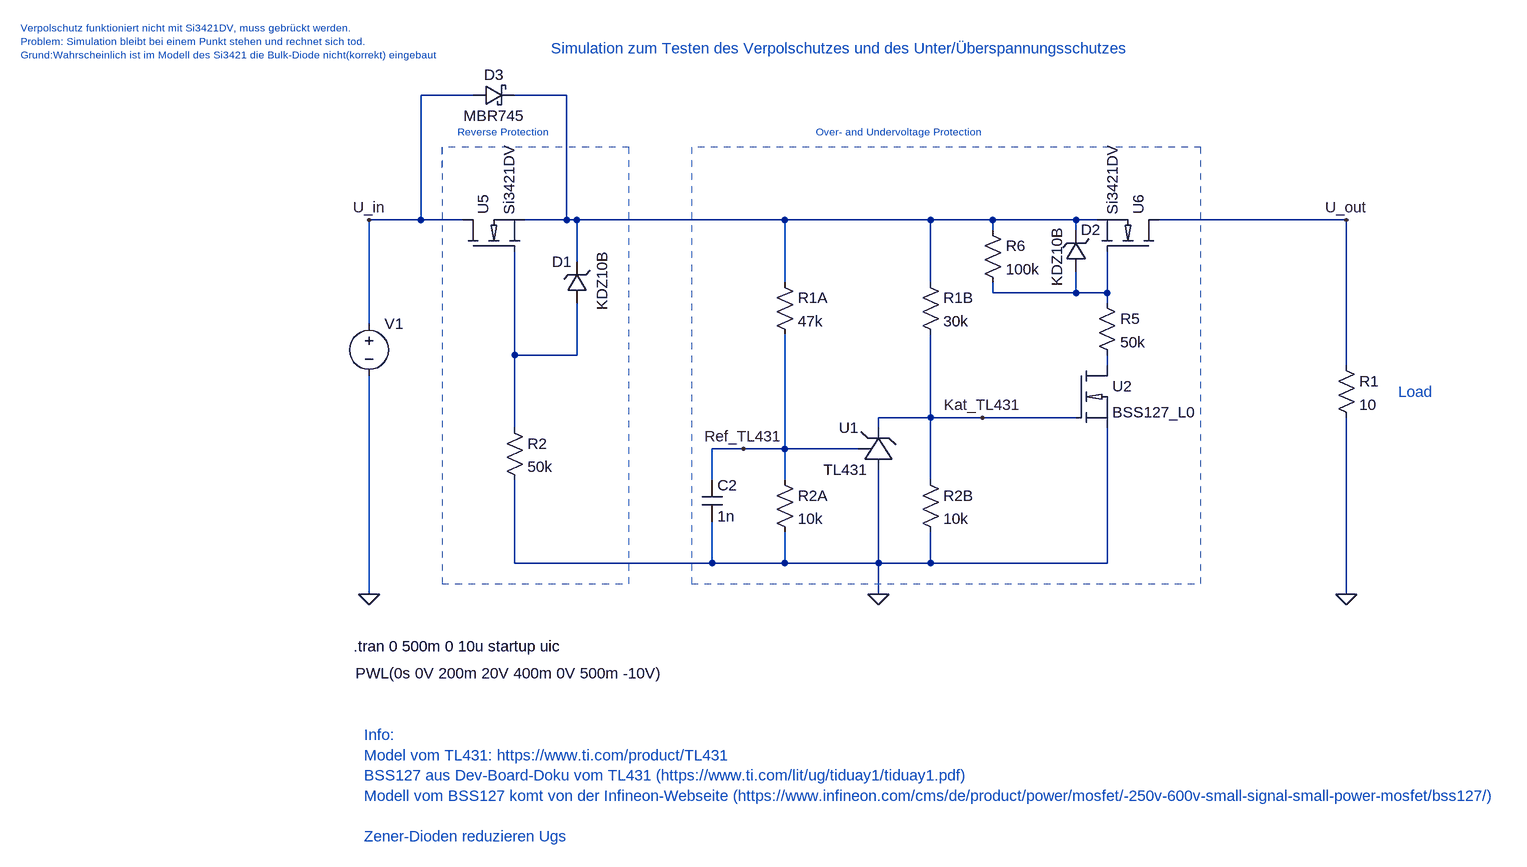
[diagram p0: schematic OV_Reverse_Protection.asc]
OV_Reverse_Protection.asc, the LTspice schematic file:
Version 4
SHEET 1 1664 836
WIRE -656 -304 -736 -304
WIRE -512 -304 -592 -304
WIRE -736 -112 -736 -304
WIRE -736 -112 -816 -112
WIRE -672 -112 -736 -112
WIRE -512 -112 -512 -304
WIRE -512 -112 -576 -112
WIRE -496 -112 -512 -112
WIRE -176 -112 -496 -112
WIRE 48 -112 -176 -112
WIRE 144 -112 48 -112
WIRE 272 -112 144 -112
WIRE 304 -112 272 -112
WIRE 688 -112 400 -112
WIRE 144 -96 144 -112
WIRE 272 -96 272 -112
WIRE -496 -48 -496 -112
WIRE -176 -16 -176 -112
WIRE 48 -16 48 -112
WIRE 144 0 144 -16
WIRE 272 0 272 -32
WIRE 272 0 144 0
WIRE 320 0 320 -64
WIRE 320 0 272 0
WIRE 320 16 320 0
WIRE -816 48 -816 -112
WIRE -592 96 -592 -64
WIRE -496 96 -496 16
WIRE -496 96 -592 96
WIRE 320 112 320 96
WIRE 688 112 688 -112
WIRE 48 192 48 64
WIRE 48 192 -32 192
WIRE 128 192 48 192
WIRE 272 192 128 192
WIRE -592 208 -592 96
WIRE -32 208 -32 192
WIRE -240 240 -288 240
WIRE -176 240 -176 64
WIRE -176 240 -240 240
WIRE -64 240 -176 240
WIRE -288 288 -288 240
WIRE -176 288 -176 240
WIRE 48 288 48 192
WIRE -592 416 -592 288
WIRE -288 416 -288 352
WIRE -288 416 -592 416
WIRE -176 416 -176 368
WIRE -176 416 -288 416
WIRE -32 416 -32 272
WIRE -32 416 -176 416
WIRE 48 416 48 368
WIRE 48 416 -32 416
WIRE 320 416 320 208
WIRE 320 416 48 416
WIRE -816 464 -816 128
WIRE -32 464 -32 416
WIRE 688 464 688 192
FLAG 688 464 0
FLAG -32 464 0
FLAG -816 464 0
FLAG -816 -112 U_in
FLAG 688 -112 U_out
FLAG -240 240 Ref_TL431
FLAG 128 192 Kat_TL431
SYMBOL voltage -816 32 R0
WINDOW 123 0 0 Left 0
WINDOW 39 0 0 Left 0
WINDOW 3 -21 553 Left 2
SYMATTR Value PWL(0s 0V 200m 20V 400m 0V 500m -10V)
SYMATTR InstName V1
SYMBOL res 672 96 R0
SYMATTR InstName R1
SYMATTR Value 10
SYMBOL res -192 272 R0
SYMATTR InstName R2A
SYMATTR Value 10k
SYMBOL res -192 -32 R0
SYMATTR InstName R1A
SYMATTR Value 47k
SYMBOL res 32 -32 R0
SYMATTR InstName R1B
SYMATTR Value 30k
SYMBOL TL431 -32 240 M0
SYMATTR InstName U1
SYMBOL res 304 0 R0
SYMATTR InstName R5
SYMATTR Value 50k
SYMBOL res 32 272 R0
SYMATTR InstName R2B
SYMATTR Value 10k
SYMBOL BSS127 272 112 R0
SYMATTR InstName U2
SYMBOL res 128 -112 R0
SYMATTR InstName R6
SYMATTR Value 100k
SYMBOL cap -304 288 R0
SYMATTR InstName C2
SYMATTR Value 1n
SYMBOL res -608 192 R0
SYMATTR InstName R2
SYMATTR Value 50k
SYMBOL zener -480 16 R180
WINDOW 0 24 64 Left 2
WINDOW 3 -23 -12 VRight 2
SYMATTR InstName D1
SYMATTR Value KDZ10B
SYMBOL zener 288 -32 R180
WINDOW 0 -22 65 Left 2
WINDOW 3 45 -23 VRight 2
SYMATTR InstName D2
SYMATTR Value KDZ10B
SYMBOL Si3421DV -672 -64 R270
SYMATTR InstName U5
SYMBOL Si3421DV 400 -64 M270
SYMATTR InstName U6
SYMBOL schottky -656 -288 R270
WINDOW 0 32 32 VTop 2
WINDOW 3 0 32 VBottom 2
SYMATTR InstName D3
SYMATTR Value MBR745
SYMATTR Description Diode
SYMATTR Type diode
TEXT -536 -376 Left 2 ;Simulation zum Testen des Verpolschutzes und des Unter/Überspannungsschutzes
TEXT -840 544 Left 2 !.tran 0 500m 0 10u startup uic
TEXT -824 680 Left 2 ;Info:\nModel vom TL431: https://www.ti.com/product/TL431\nBSS127 aus Dev-Board-Doku vom TL431 (https://www.ti.com/lit/ug/tiduay1/tiduay1.pdf)\nModell vom BSS127 komt von der Infineon-Webseite (https://www.infineon.com/cms/de/product/power/mosfet/-250v-600v-small-signal-small-power-mosfet/bss127/)\n \nZener-Dioden reduzieren Ugs
TEXT -680 -248 Left 1 ;Reverse Protection
TEXT 768 152 Left 2 ;Load
TEXT -128 -248 Left 1 ;Over- and Undervoltage Protection
TEXT -1352 -408 Left 1 ;Verpolschutz funktioniert nicht mit Si3421DV, muss gebrückt werden.\nProblem: Simulation bleibt bei einem Punkt stehen und rechnet sich tod.\nGrund:Wahrscheinlich ist im Modell des Si3421 die Bulk-Diode nicht(korrekt) eingebaut
LINE Normal -416 448 -416 -224 2
LINE Normal -704 448 -416 448 2
LINE Normal -704 -224 -704 448 2
LINE Normal -704 -224 -704 -224 2
LINE Normal -704 -224 -704 -224 2
LINE Normal -704 -192 -704 -224 2
LINE Normal -416 -224 -704 -224 2
LINE Normal -416 -224 -416 -224 2
LINE Normal -416 -224 -416 -224 2
RECTANGLE Normal 464 -224 -320 448 2

The netlist it stands for:
* OV_Reverse_Protection.asc
V1 U_in 0 PWL(0s 0V 200m 20V 400m 0V 500m -10V)
R1 U_out 0 10
R2A Ref_TL431 0 10k
R1A N001 Ref_TL431 47k
R1B N001 Kat_TL431 30k
XU1 Kat_TL431 0 Ref_TL431 TL431  ; pins K A ADJ
R5 N002 N004 50k
R2B Kat_TL431 0 10k
XU2 N004 Kat_TL431 0 BSS127_L0  ; pins drain gate source
R6 N001 N002 100k
C2 Ref_TL431 0 1n
R2 N003 0 50k
D1 N003 N001 KDZ10B
D2 N002 N001 KDZ10B
XU5 U_in N003 N001 Si3421DV  ; pins D G S
XU6 U_out N002 N001 Si3421DV  ; pins D G S
D3 U_in N001 MBR745
.model D D
.lib standard.dio
* Simulation zum Testen des Verpolschutzes und des Unter/Überspannungsschutzes
.tran 0 500m 0 10u startup uic
* Info:
* Model vom TL431: https://www.ti.com/product/TL431
* BSS127 aus Dev-Board-Doku vom TL431 (https://www.ti.com/lit/ug/tiduay1/tiduay1.pdf)
* Modell vom BSS127 komt von der Infineon-Webseite (https://www.infineon.com/cms/de/product/power/mosfet/-250v-600v-small-signal-small-power-mosfet/bss127/)
* Zener-Dioden reduzieren Ugs
* Reverse Protection
* Load
* Over- and Undervoltage Protection
* Verpolschutz funktioniert nicht mit Si3421DV, muss gebrückt werden.
* Problem: Simulation bleibt bei einem Punkt stehen und rechnet sich tod.
* Grund:Wahrscheinlich ist im Modell des Si3421 die Bulk-Diode nicht(korrekt) eingebaut
.lib TL431.net
.lib BSS127.lib
.lib Si3421DV.lib
.backanno
.end